# EAGLE schematic spectrum analyzer (EAGLE 6.0)
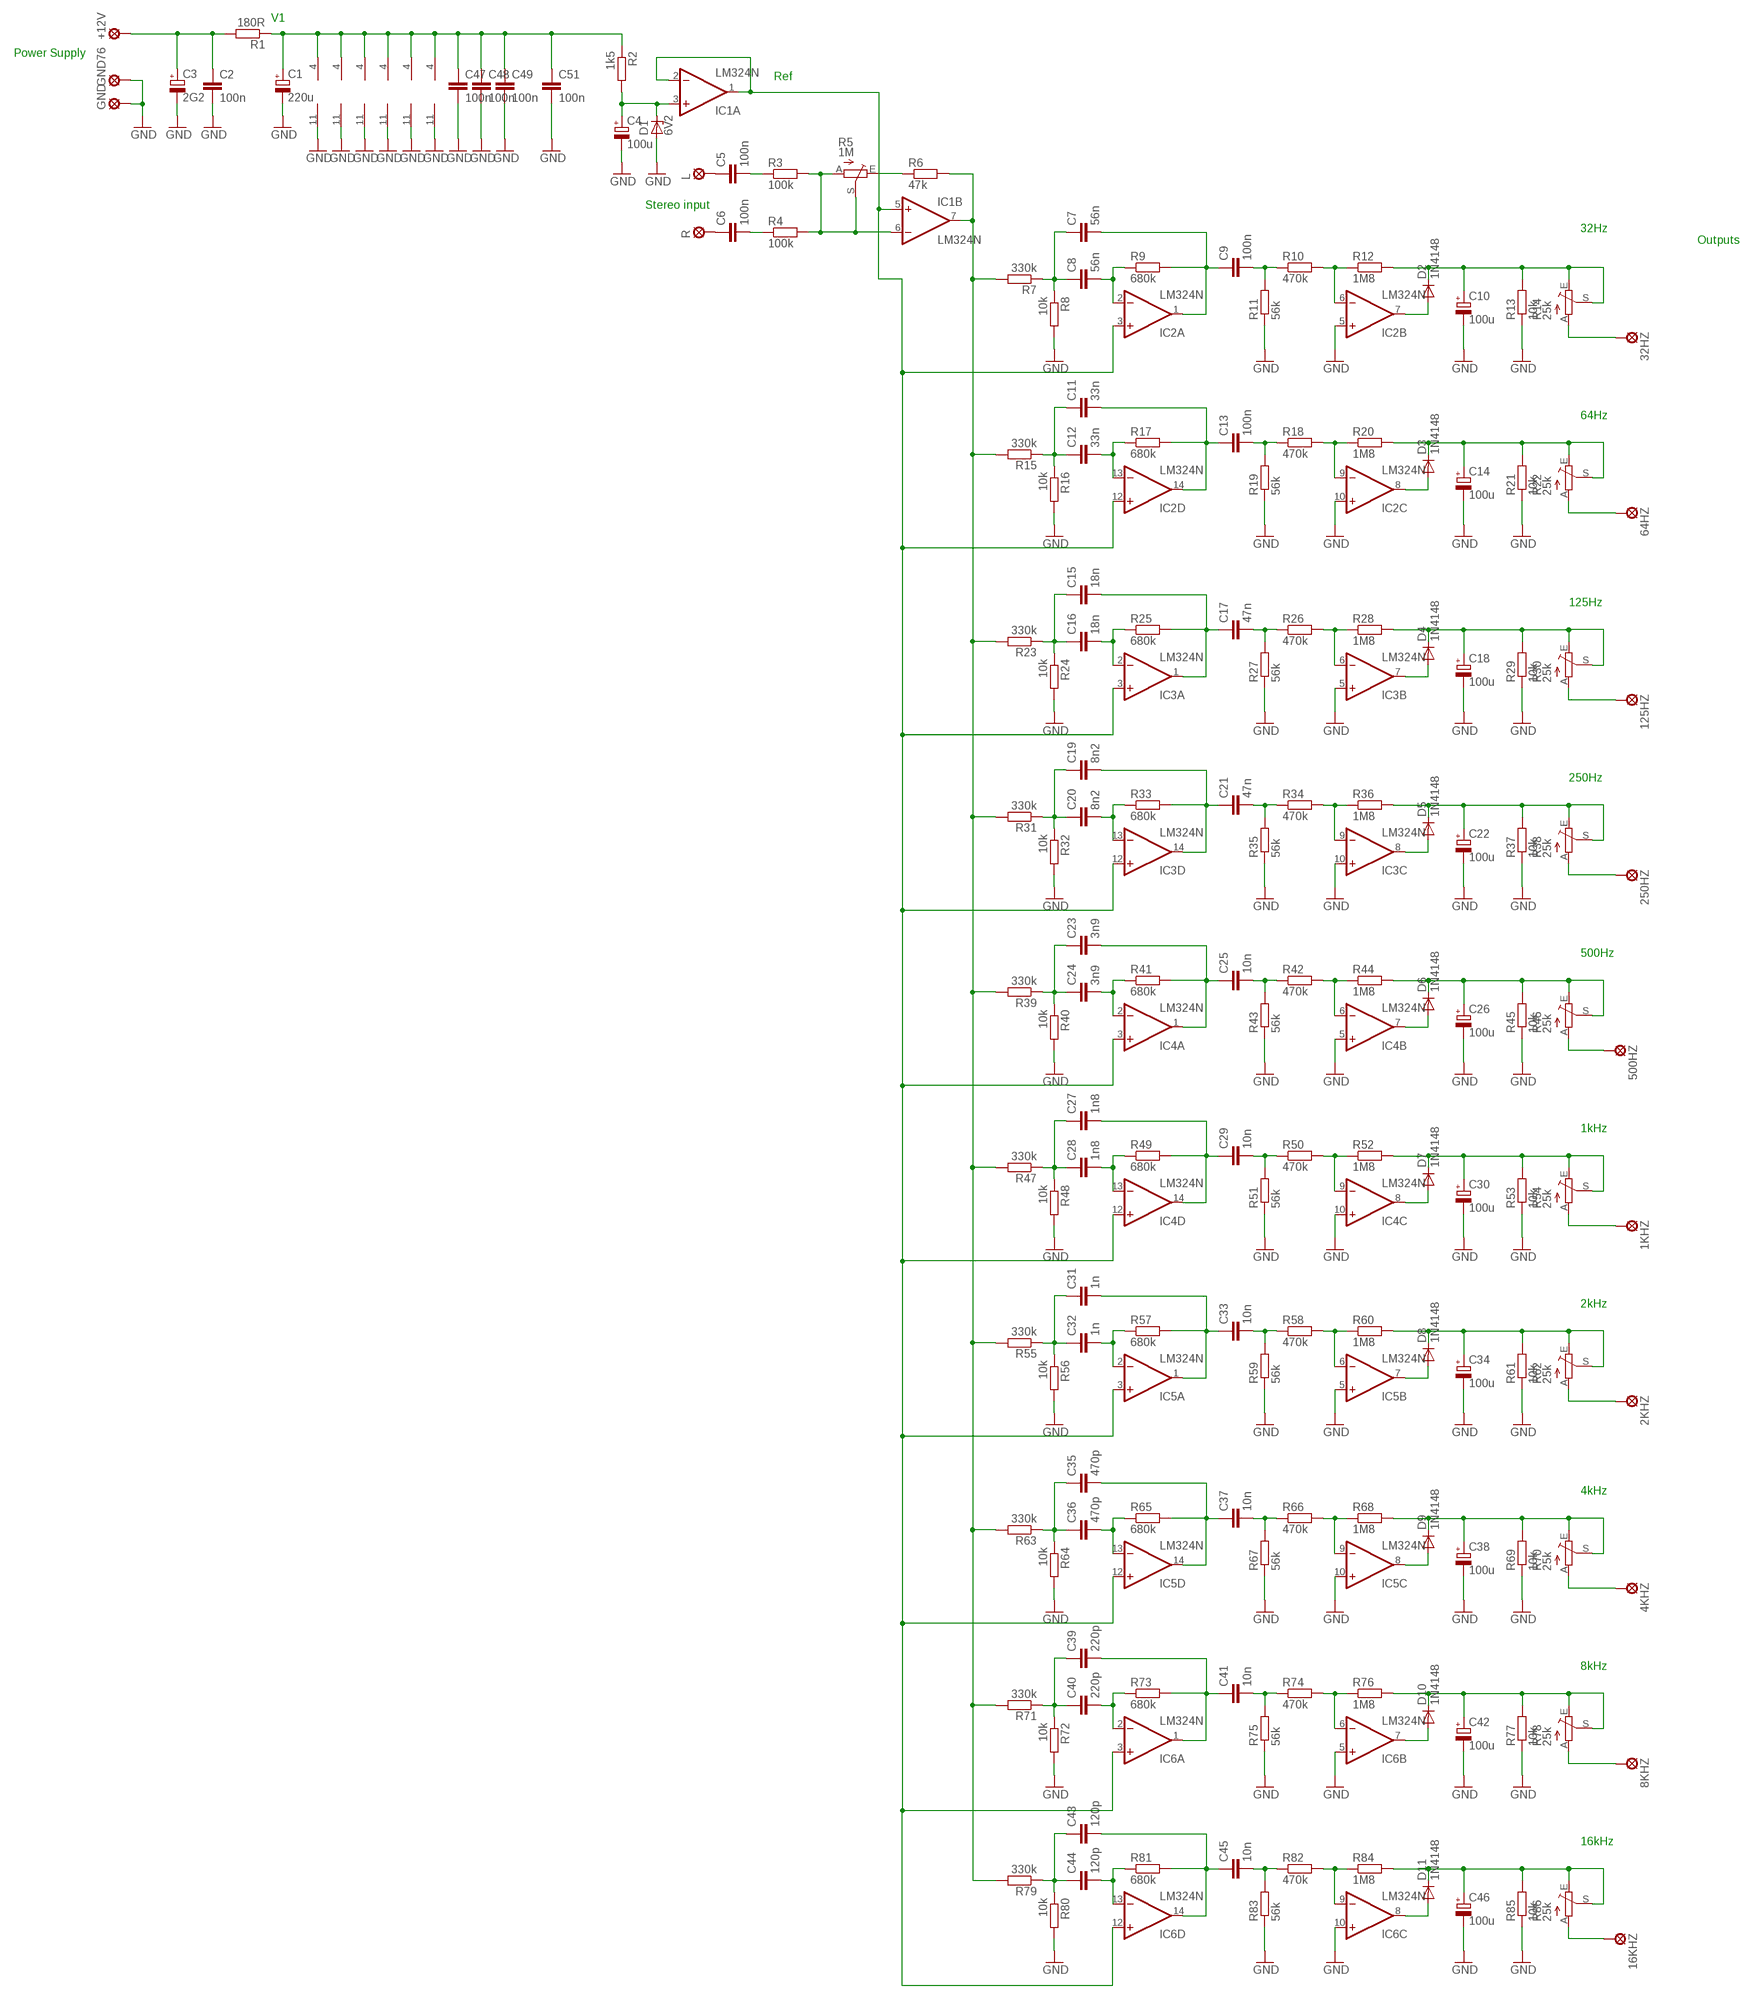
[diagram p0: schematic, sheet 1]

## Parts
1KHZ  LSP10  [LSP10]
2KHZ  LSP10  [LSP10]
4KHZ  LSP10  [LSP10]
8KHZ  LSP10  [LSP10]
16KHZ  LSP10  [LSP10]
32HZ  LSP10  [LSP10]
64HZ  LSP10  [LSP10]
125HZ  LSP10  [LSP10]
250HZ  LSP10  [LSP10]
500HZ  LSP10  [LSP10]
+12V  LSP10  [LSP10]
C1  220u  CPOL-EUE2.5-7  [E2,5-7]
C2  100n  C-EU050-025X075  [C050-025X075]
C3  2G2  CPOL-EUE5-10.5  [E5-10,5]
C4  100u  CPOL-EUE2.5-7  [E2,5-7]
C5  100n  C-EU050-025X075  [C050-025X075]
C6  100n  C-EU050-025X075  [C050-025X075]
C7  56n  C-EU050-025X075  [C050-025X075]
C8  56n  C-EU050-025X075  [C050-025X075]
C9  100n  C-EU050-025X075  [C050-025X075]
C10  100u  CPOL-EUE2.5-7  [E2,5-7]
C11  33n  C-EU050-025X075  [C050-025X075]
C12  33n  C-EU050-025X075  [C050-025X075]
C13  100n  C-EU050-025X075  [C050-025X075]
C14  100u  CPOL-EUE2.5-7  [E2,5-7]
C15  18n  C-EU050-025X075  [C050-025X075]
C16  18n  C-EU050-025X075  [C050-025X075]
C17  47n  C-EU050-025X075  [C050-025X075]
C18  100u  CPOL-EUE2.5-7  [E2,5-7]
C19  8n2  C-EU050-025X075  [C050-025X075]
C20  8n2  C-EU050-025X075  [C050-025X075]
C21  47n  C-EU050-025X075  [C050-025X075]
C22  100u  CPOL-EUE2.5-7  [E2,5-7]
C23  3n9  C-EU050-025X075  [C050-025X075]
C24  3n9  C-EU050-025X075  [C050-025X075]
C25  10n  C-EU050-025X075  [C050-025X075]
C26  100u  CPOL-EUE2.5-7  [E2,5-7]
C27  1n8  C-EU050-025X075  [C050-025X075]
C28  1n8  C-EU050-025X075  [C050-025X075]
C29  10n  C-EU050-025X075  [C050-025X075]
C30  100u  CPOL-EUE2.5-7  [E2,5-7]
C31  1n  C-EU050-025X075  [C050-025X075]
C32  1n  C-EU050-025X075  [C050-025X075]
C33  10n  C-EU050-025X075  [C050-025X075]
C34  100u  CPOL-EUE2.5-7  [E2,5-7]
C35  470p  C-EU050-025X075  [C050-025X075]
C36  470p  C-EU050-025X075  [C050-025X075]
C37  10n  C-EU050-025X075  [C050-025X075]
C38  100u  CPOL-EUE2.5-7  [E2,5-7]
C39  220p  C-EU050-025X075  [C050-025X075]
C40  220p  C-EU050-025X075  [C050-025X075]
C41  10n  C-EU050-025X075  [C050-025X075]
C42  100u  CPOL-EUE2.5-7  [E2,5-7]
C43  120p  C-EU050-025X075  [C050-025X075]
C44  120p  C-EU050-025X075  [C050-025X075]
C45  10n  C-EU050-025X075  [C050-025X075]
C46  100u  CPOL-EUE2.5-7  [E2,5-7]
C47  100n  C-EU050-025X075  [C050-025X075]
C48  100n  C-EU050-025X075  [C050-025X075]
C49  100n  C-EU050-025X075  [C050-025X075]
C51  100n  C-EU050-025X075  [C050-025X075]
D1  6V2  1N821  [DO35Z10]
D2  1N4148  1N4148DO35-10  [DO35-10]
D3  1N4148  1N4148DO35-10  [DO35-10]
D4  1N4148  1N4148DO35-10  [DO35-10]
D5  1N4148  1N4148DO35-10  [DO35-10]
D6  1N4148  1N4148DO35-10  [DO35-10]
D7  1N4148  1N4148DO35-10  [DO35-10]
D8  1N4148  1N4148DO35-10  [DO35-10]
D9  1N4148  1N4148DO35-10  [DO35-10]
D10  1N4148  1N4148DO35-10  [DO35-10]
D11  1N4148  1N4148DO35-10  [DO35-10]
GND  LSP10  [LSP10]
GND76  LSP10  [LSP10]
IC1  LM324N  [DIL14]
IC2  LM324N  [DIL14]
IC3  LM324N  [DIL14]
IC4  LM324N  [DIL14]
IC5  LM324N  [DIL14]
IC6  LM324N  [DIL14]
L  LSP10  [LSP10]
R  LSP10  [LSP10]
R1  180R  R-EU_0207/10  [0207/10]
R2  1k5  R-EU_0207/10  [0207/10]
R3  100k  R-EU_0207/10  [0207/10]
R4  100k  R-EU_0207/10  [0207/10]
R5  1M  TRIM_EU-CA6V  [CA6V]
R6  47k  R-EU_0207/10  [0207/10]
R7  330k  R-EU_0207/10  [0207/10]
R8  10k  R-EU_0207/10  [0207/10]
R9  680k  R-EU_0207/10  [0207/10]
R10  470k  R-EU_0207/10  [0207/10]
R11  56k  R-EU_0207/10  [0207/10]
R12  1M8  R-EU_0207/10  [0207/10]
R13  10k  R-EU_0207/10  [0207/10]
R14  25k  TRIM_EU-CA6V  [CA6V]
R15  330k  R-EU_0207/10  [0207/10]
R16  10k  R-EU_0207/10  [0207/10]
R17  680k  R-EU_0207/10  [0207/10]
R18  470k  R-EU_0207/10  [0207/10]
R19  56k  R-EU_0207/10  [0207/10]
R20  1M8  R-EU_0207/10  [0207/10]
R21  10k  R-EU_0207/10  [0207/10]
R22  25k  TRIM_EU-CA6V  [CA6V]
R23  330k  R-EU_0207/10  [0207/10]
R24  10k  R-EU_0207/10  [0207/10]
R25  680k  R-EU_0207/10  [0207/10]
R26  470k  R-EU_0207/10  [0207/10]
R27  56k  R-EU_0207/10  [0207/10]
R28  1M8  R-EU_0207/10  [0207/10]
R29  10k  R-EU_0207/10  [0207/10]
R30  25k  TRIM_EU-CA6V  [CA6V]
R31  330k  R-EU_0207/10  [0207/10]
R32  10k  R-EU_0207/10  [0207/10]
R33  680k  R-EU_0207/10  [0207/10]
R34  470k  R-EU_0207/10  [0207/10]
R35  56k  R-EU_0207/10  [0207/10]
R36  1M8  R-EU_0207/10  [0207/10]
R37  10k  R-EU_0207/10  [0207/10]
R38  25k  TRIM_EU-CA6V  [CA6V]
R39  330k  R-EU_0207/10  [0207/10]
R40  10k  R-EU_0207/10  [0207/10]
R41  680k  R-EU_0207/10  [0207/10]
R42  470k  R-EU_0207/10  [0207/10]
R43  56k  R-EU_0207/10  [0207/10]
R44  1M8  R-EU_0207/10  [0207/10]
R45  10k  R-EU_0207/10  [0207/10]
R46  25k  TRIM_EU-CA6V  [CA6V]
R47  330k  R-EU_0207/10  [0207/10]
R48  10k  R-EU_0207/10  [0207/10]
R49  680k  R-EU_0207/10  [0207/10]
R50  470k  R-EU_0207/10  [0207/10]
R51  56k  R-EU_0207/10  [0207/10]
R52  1M8  R-EU_0207/10  [0207/10]
R53  10k  R-EU_0207/10  [0207/10]
R54  25k  TRIM_EU-CA6V  [CA6V]
R55  330k  R-EU_0207/10  [0207/10]
R56  10k  R-EU_0207/10  [0207/10]
R57  680k  R-EU_0207/10  [0207/10]
R58  470k  R-EU_0207/10  [0207/10]
R59  56k  R-EU_0207/10  [0207/10]
R60  1M8  R-EU_0207/10  [0207/10]
R61  10k  R-EU_0207/10  [0207/10]
R62  25k  TRIM_EU-CA6V  [CA6V]
R63  330k  R-EU_0207/10  [0207/10]
R64  10k  R-EU_0207/10  [0207/10]
R65  680k  R-EU_0207/10  [0207/10]
R66  470k  R-EU_0207/10  [0207/10]
R67  56k  R-EU_0207/10  [0207/10]
R68  1M8  R-EU_0207/10  [0207/10]
R69  10k  R-EU_0207/10  [0207/10]
R70  25k  TRIM_EU-CA6V  [CA6V]
R71  330k  R-EU_0207/10  [0207/10]
R72  10k  R-EU_0207/10  [0207/10]
R73  680k  R-EU_0207/10  [0207/10]
R74  470k  R-EU_0207/10  [0207/10]
R75  56k  R-EU_0207/10  [0207/10]
R76  1M8  R-EU_0207/10  [0207/10]
R77  10k  R-EU_0207/10  [0207/10]
R78  25k  TRIM_EU-CA6V  [CA6V]
R79  330k  R-EU_0207/10  [0207/10]
R80  10k  R-EU_0207/10  [0207/10]
R81  680k  R-EU_0207/10  [0207/10]
R82  470k  R-EU_0207/10  [0207/10]
R83  56k  R-EU_0207/10  [0207/10]
R84  1M8  R-EU_0207/10  [0207/10]
R85  10k  R-EU_0207/10  [0207/10]
R86  25k  TRIM_EU-CA6V  [CA6V]

## Nets
GND: C1.- C2.2 C3.- C4.- C10.- C14.- C18.- C22.- C26.- C30.- C34.- C38.- C42.- C46.- C47.2 C48.2 C49.2 C51.2 D1.A GND76.MP GND.MP IC1.11(P:V-) IC2.5(B:+IN) IC2.10(C:+IN) IC2.11(P:V-) IC3.5(B:+IN) IC3.10(C:+IN) IC3.11(P:V-) IC4.5(B:+IN) IC4.10(C:+IN) IC4.11(P:V-) IC5.5(B:+IN) IC5.10(C:+IN) IC5.11(P:V-) IC6.5(B:+IN) IC6.10(C:+IN) IC6.11(P:V-) R8.2 R11.1 R13.1 R16.2 R19.1 R21.1 R24.2 R27.1 R29.1 R32.2 R35.1 R37.1 R40.2 R43.1 R45.1 R48.2 R51.1 R53.1 R56.2 R59.1 R61.1 R64.2 R67.1 R69.1 R72.2 R75.1 R77.1 R80.2 R83.1 R85.1
N$1: +12V.MP C2.1 C3.+ R1.2
N$2: C1.+ C47.1 C48.1 C49.1 C51.1 IC1.4(P:V+) IC2.4(P:V+) IC3.4(P:V+) IC4.4(P:V+) IC5.4(P:V+) IC6.4(P:V+) R1.1 R2.1
N$3: C4.+ D1.C IC1.3(A:+IN) R2.2
N$5: C6.2 R4.1
N$6: C5.2 R3.1
N$7: C5.1 L.MP
N$8: C6.1 R.MP
N$9: IC1.6(B:-IN) R3.2 R4.2 R5.A R5.S
N$10: R5.E R6.1
N$11: C7.1 C8.1 R7.1 R8.1
N$12: IC1.7(B:OUT) R6.2 R7.2 R15.2 R23.2 R31.2 R39.2 R47.2 R55.2 R63.2 R71.2 R79.2
N$13: C8.2 IC2.2(A:-IN) R9.1
N$14: C7.2 C9.1 IC2.1(A:OUT) R9.2
N$15: C9.2 R10.1 R11.2
N$16: IC2.6(B:-IN) R10.2 R12.1
N$17: C10.+ D2.C R12.2 R13.2 R14.E R14.S
N$18: D2.A IC2.7(B:OUT)
N$19: 32HZ.MP R14.A
N$20: C11.1 C12.1 R15.1 R16.1
N$21: C12.2 IC2.13(D:-IN) R17.1
N$22: C11.2 C13.1 IC2.14(D:OUT) R17.2
N$23: C13.2 R18.1 R19.2
N$24: IC2.9(C:-IN) R18.2 R20.1
N$25: C14.+ D3.C R20.2 R21.2 R22.E R22.S
N$26: D3.A IC2.8(C:OUT)
N$27: C15.1 C16.1 R23.1 R24.1
N$28: C16.2 IC3.2(A:-IN) R25.1
N$29: C15.2 C17.1 IC3.1(A:OUT) R25.2
N$30: C17.2 R26.1 R27.2
N$31: IC3.6(B:-IN) R26.2 R28.1
N$32: C18.+ D4.C R28.2 R29.2 R30.E R30.S
N$33: D4.A IC3.7(B:OUT)
N$34: C19.1 C20.1 R31.1 R32.1
N$35: C20.2 IC3.13(D:-IN) R33.1
N$36: C19.2 C21.1 IC3.14(D:OUT) R33.2
N$37: C21.2 R34.1 R35.2
N$38: IC3.9(C:-IN) R34.2 R36.1
N$39: C22.+ D5.C R36.2 R37.2 R38.E R38.S
N$40: D5.A IC3.8(C:OUT)
N$41: C23.1 C24.1 R39.1 R40.1
N$42: C24.2 IC4.2(A:-IN) R41.1
N$43: C23.2 C25.1 IC4.1(A:OUT) R41.2
N$44: C25.2 R42.1 R43.2
N$45: IC4.6(B:-IN) R42.2 R44.1
N$46: C26.+ D6.C R44.2 R45.2 R46.E R46.S
N$47: D6.A IC4.7(B:OUT)
N$48: C27.1 C28.1 R47.1 R48.1
N$49: C28.2 IC4.13(D:-IN) R49.1
N$50: C27.2 C29.1 IC4.14(D:OUT) R49.2
N$51: C29.2 R50.1 R51.2
N$52: IC4.9(C:-IN) R50.2 R52.1
N$53: C30.+ D7.C R52.2 R53.2 R54.E R54.S
N$54: D7.A IC4.8(C:OUT)
N$55: C31.1 C32.1 R55.1 R56.1
N$56: C32.2 IC5.2(A:-IN) R57.1
N$57: C31.2 C33.1 IC5.1(A:OUT) R57.2
N$58: C33.2 R58.1 R59.2
N$59: IC5.6(B:-IN) R58.2 R60.1
N$60: C34.+ D8.C R60.2 R61.2 R62.E R62.S
N$61: D8.A IC5.7(B:OUT)
N$62: C35.1 C36.1 R63.1 R64.1
N$63: C36.2 IC5.13(D:-IN) R65.1
N$64: C35.2 C37.1 IC5.14(D:OUT) R65.2
N$65: C37.2 R66.1 R67.2
N$66: IC5.9(C:-IN) R66.2 R68.1
N$67: C38.+ D9.C R68.2 R69.2 R70.E R70.S
N$68: D9.A IC5.8(C:OUT)
N$69: C39.1 C40.1 R71.1 R72.1
N$70: C40.2 IC6.2(A:-IN) R73.1
N$71: C39.2 C41.1 IC6.1(A:OUT) R73.2
N$72: C41.2 R74.1 R75.2
N$73: IC6.6(B:-IN) R74.2 R76.1
N$74: C42.+ D10.C R76.2 R77.2 R78.E R78.S
N$75: D10.A IC6.7(B:OUT)
N$76: C43.1 C44.1 R79.1 R80.1
N$77: C44.2 IC6.13(D:-IN) R81.1
N$78: C43.2 C45.1 IC6.14(D:OUT) R81.2
N$79: C45.2 R82.1 R83.2
N$80: IC6.9(C:-IN) R82.2 R84.1
N$81: C46.+ D11.C R84.2 R85.2 R86.E R86.S
N$82: D11.A IC6.8(C:OUT)
N$83: 64HZ.MP R22.A
N$84: 125HZ.MP R30.A
N$85: 250HZ.MP R38.A
N$86: 500HZ.MP R46.A
N$87: 1KHZ.MP R54.A
N$88: 2KHZ.MP R62.A
N$89: IC1.1(A:OUT) IC1.2(A:-IN) IC1.5(B:+IN) IC2.3(A:+IN) IC2.12(D:+IN) IC3.3(A:+IN) IC3.12(D:+IN) IC4.3(A:+IN) IC4.12(D:+IN) IC5.3(A:+IN) IC5.12(D:+IN) IC6.3(A:+IN) IC6.12(D:+IN)
N$90: 4KHZ.MP R70.A
N$91: 8KHZ.MP R78.A
N$92: 16KHZ.MP R86.A
Unconnected: IC1.8(C:OUT) IC1.9(C:-IN) IC1.10(C:+IN) IC1.12(D:+IN) IC1.13(D:-IN) IC1.14(D:OUT)

## Notes on the sheet
- V1
- Power Supply
- Ref
- Stereo input
- 32Hz
- Outputs
- 64Hz
- 125Hz
- 250Hz
- 500Hz
- 1kHz
- 2kHz
- 4kHz
- 8kHz
- 16kHz

## Library data of the parts
1KHZ 2KHZ 4KHZ 8KHZ 16KHZ 32HZ 64HZ 125HZ 250HZ 500HZ +12V GND GND76 L R = solpad:LSP10: SOLDER PAD drill 1.0 mm, distributor Buerklin, 12H555
C1 C3 C4 C10 C14 C18 C22 C26 C30 C34 C38 C42 C46 = rcl:CPOL-EU: POLARIZED CAPACITOR, European symbol
C2 C5-C9 C11-C13 C15-C17 C19-C21 C23-C25 C27-C29 C31-C33 C35-C37 C39-C41 C43-C45 C47-C49 C51 = rcl:C-EU: CAPACITOR, European symbol
D1 = diode:1N821: Reference DIODE temperature compensated, 6,2 V
D2-D11 = diode:1N4148: DIODE high speed (Philips)
IC1-IC6 = linear:LM324: OP AMP
R1-R4 R6-R13 R15-R21 R23-R29 R31-R37 R39-R45 R47-R53 R55-R61 R63-R69 R71-R77 R79-R85 = rcl:R-EU_: RESISTOR, European symbol
R5 R14 R22 R30 R38 R46 R54 R62 R70 R78 R86 = pot:TRIM_EU-: POTENTIOMETER